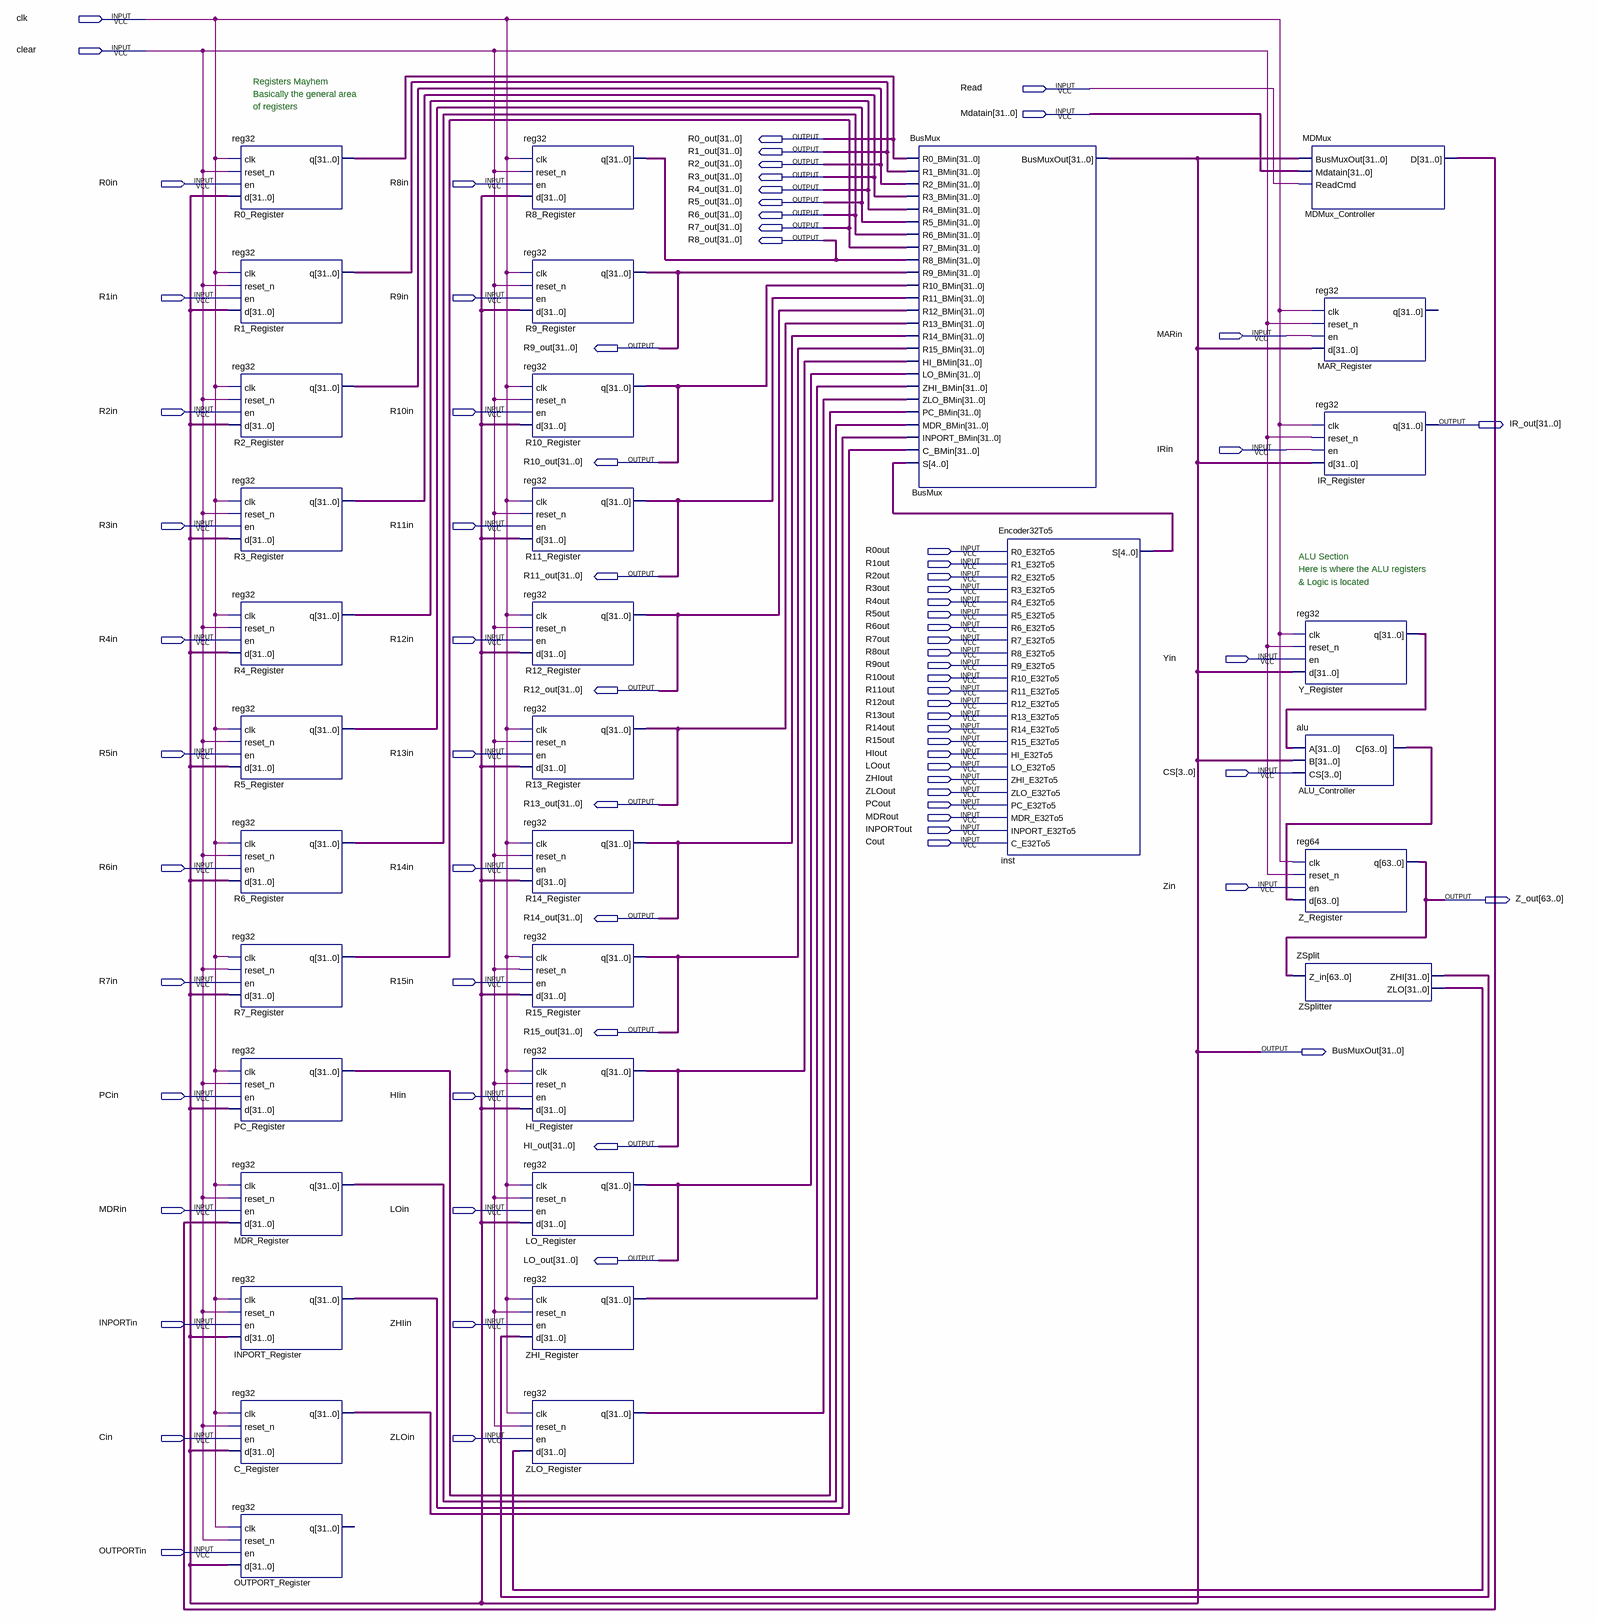
[diagram p0: schematic sheet]
// Quartus schematic phase1.bdf as structural Verilog: 34 symbols, 79 pins
module phase1 (
  input  clk,
  input  clear,
  input  Read,
  input  [31:0] Mdatain,
  input  R0in,
  input  R8in,
  input  R1in,
  input  R9in,
  input  MARin,
  input  R2in,
  input  R10in,
  input  IRin,
  input  R3in,
  input  R11in,
  input  R0out,
  input  R1out,
  input  R2out,
  input  R3out,
  input  R4out,
  input  R5out,
  input  R6out,
  input  R4in,
  input  R12in,
  input  R7out,
  input  R8out,
  input  Yin,
  input  R9out,
  input  R10out,
  input  R11out,
  input  R12out,
  input  R13out,
  input  R14out,
  input  R15out,
  input  R5in,
  input  R13in,
  input  HIout,
  input  LOout,
  input  [3:0] CS,
  input  ZHIout,
  input  ZLOout,
  input  PCout,
  input  MDRout,
  input  INPORTout,
  input  Cout,
  input  R6in,
  input  R14in,
  input  Zin,
  input  R7in,
  input  R15in,
  input  PCin,
  input  HIin,
  input  MDRin,
  input  LOin,
  input  INPORTin,
  input  ZHIin,
  input  Cin,
  input  ZLOin,
  input  OUTPORTin,
  output [31:0] R0_out,
  output [31:0] R1_out,
  output [31:0] R2_out,
  output [31:0] R3_out,
  output [31:0] R4_out,
  output [31:0] R5_out,
  output [31:0] R6_out,
  output [31:0] R7_out,
  output [31:0] R8_out,
  output [31:0] R9_out,
  output [31:0] IR_out,
  output [31:0] R10_out,
  output [31:0] R11_out,
  output [31:0] R12_out,
  output [31:0] R13_out,
  output [63:0] Z_out,
  output [31:0] R14_out,
  output [31:0] R15_out,
  output [31:0] BusMuxOut,
  output [31:0] HI_out,
  output [31:0] LO_out
);

  wire [4:0] inst_s;
  wire [31:0] C_Register_q, INPORT_Register_q, MDMux_Controller_d, MDR_Register_q, PC_Register_q,
       Y_Register_q, ZHI_Register_q, ZLO_Register_q, ZSplitter_zhi, ZSplitter_zlo;
  wire [63:0] ALU_Controller_c;

  reg32 R0_Register (.clk(clk), .reset_n(clear), .en(R0in), .d(BusMuxOut), .q(R0_out));
  reg32 R1_Register (.clk(clk), .reset_n(clear), .en(R1in), .d(BusMuxOut), .q(R1_out));
  reg32 R2_Register (.clk(clk), .reset_n(clear), .en(R2in), .d(BusMuxOut), .q(R2_out));
  reg32 R3_Register (.clk(clk), .reset_n(clear), .en(R3in), .d(BusMuxOut), .q(R3_out));
  reg32 R4_Register (.clk(clk), .reset_n(clear), .en(R4in), .d(BusMuxOut), .q(R4_out));
  reg32 R5_Register (.clk(clk), .reset_n(clear), .en(R5in), .d(BusMuxOut), .q(R5_out));
  reg32 R6_Register (.clk(clk), .reset_n(clear), .en(R6in), .d(BusMuxOut), .q(R6_out));
  reg32 R7_Register (.clk(clk), .reset_n(clear), .en(R7in), .d(BusMuxOut), .q(R7_out));
  reg32 PC_Register (.clk(clk), .reset_n(clear), .en(PCin), .d(BusMuxOut), .q(PC_Register_q));
  reg32 MDR_Register (.clk(clk), .reset_n(clear), .en(MDRin), .d(MDMux_Controller_d), .q(MDR_Register_q));
  reg32 INPORT_Register (.clk(clk), .reset_n(clear), .en(INPORTin), .d(BusMuxOut), .q(INPORT_Register_q));
  reg32 C_Register (.clk(clk), .reset_n(clear), .en(Cin), .d(BusMuxOut), .q(C_Register_q));
  reg32 OUTPORT_Register (.clk(clk), .reset_n(clear), .en(OUTPORTin), .d(BusMuxOut));  // open: q
  reg32 R8_Register (.clk(clk), .reset_n(clear), .en(R8in), .d(BusMuxOut), .q(R8_out));
  reg32 R9_Register (.clk(clk), .reset_n(clear), .en(R9in), .d(BusMuxOut), .q(R9_out));
  reg32 R10_Register (.clk(clk), .reset_n(clear), .en(R10in), .d(BusMuxOut), .q(R10_out));
  reg32 R11_Register (.clk(clk), .reset_n(clear), .en(R11in), .d(BusMuxOut), .q(R11_out));
  reg32 R12_Register (.clk(clk), .reset_n(clear), .en(R12in), .d(BusMuxOut), .q(R12_out));
  reg32 R13_Register (.clk(clk), .reset_n(clear), .en(R13in), .d(BusMuxOut), .q(R13_out));
  reg32 R14_Register (.clk(clk), .reset_n(clear), .en(R14in), .d(BusMuxOut), .q(R14_out));
  reg32 R15_Register (.clk(clk), .reset_n(clear), .en(R15in), .d(BusMuxOut), .q(R15_out));
  reg32 HI_Register (.clk(clk), .reset_n(clear), .en(HIin), .d(BusMuxOut), .q(HI_out));
  reg32 LO_Register (.clk(clk), .reset_n(clear), .en(LOin), .d(BusMuxOut), .q(LO_out));
  reg32 ZHI_Register (.clk(clk), .reset_n(clear), .en(ZHIin), .d(ZSplitter_zhi), .q(ZHI_Register_q));
  reg32 ZLO_Register (.clk(clk), .reset_n(clear), .en(ZLOin), .d(ZSplitter_zlo), .q(ZLO_Register_q));
  BusMux BusMux (
    .R0_BMin(R0_out), .R1_BMin(R1_out), .R2_BMin(R2_out), .R3_BMin(R3_out), .R4_BMin(R4_out),
    .R5_BMin(R5_out), .R6_BMin(R6_out), .R7_BMin(R7_out), .R8_BMin(R8_out), .R9_BMin(R9_out),
    .R10_BMin(R10_out), .R11_BMin(R11_out), .R12_BMin(R12_out), .R13_BMin(R13_out), .R14_BMin(R14_out),
    .R15_BMin(R15_out), .HI_BMin(HI_out), .LO_BMin(LO_out), .ZHI_BMin(ZHI_Register_q),
    .ZLO_BMin(ZLO_Register_q), .PC_BMin(PC_Register_q), .MDR_BMin(MDR_Register_q),
    .INPORT_BMin(INPORT_Register_q), .C_BMin(C_Register_q), .S(inst_s), .BusMuxOut(BusMuxOut));
  Encoder32To5 inst (
    .R0_E32To5(R0out), .R1_E32To5(R1out), .R2_E32To5(R2out), .R3_E32To5(R3out), .R4_E32To5(R4out),
    .R5_E32To5(R5out), .R6_E32To5(R6out), .R7_E32To5(R7out), .R8_E32To5(R8out), .R9_E32To5(R9out),
    .R10_E32To5(R10out), .R11_E32To5(R11out), .R12_E32To5(R12out), .R13_E32To5(R13out), .R14_E32To5(R14out),
    .R15_E32To5(R15out), .HI_E32To5(HIout), .LO_E32To5(LOout), .ZHI_E32To5(ZHIout), .ZLO_E32To5(ZLOout),
    .PC_E32To5(PCout), .MDR_E32To5(MDRout), .INPORT_E32To5(INPORTout), .C_E32To5(Cout), .S(inst_s));
  MDMux MDMux_Controller (.BusMuxOut(BusMuxOut), .Mdatain(Mdatain), .ReadCmd(Read), .D(MDMux_Controller_d));
  reg32 MAR_Register (.clk(clk), .reset_n(clear), .en(MARin), .d(BusMuxOut));  // open: q
  reg32 IR_Register (.clk(clk), .reset_n(clear), .en(IRin), .d(BusMuxOut), .q(IR_out));
  reg32 Y_Register (.clk(clk), .reset_n(clear), .en(Yin), .d(BusMuxOut), .q(Y_Register_q));
  alu ALU_Controller (.A(Y_Register_q), .B(BusMuxOut), .CS(CS), .C(ALU_Controller_c));
  reg64 Z_Register (.clk(clk), .reset_n(clear), .en(Zin), .d(ALU_Controller_c), .q(Z_out));
  ZSplit ZSplitter (.Z_in(Z_out), .ZHI(ZSplitter_zhi), .ZLO(ZSplitter_zlo));

  // Notes on the sheet:
  //   Registers Mayhem
  //   Basically the general area
  //   of registers
  //   ALU Section
  //   Here is where the ALU registers
  //   & Logic is located
endmodule
